# EAGLE design QT Stick (EAGLE 9.6.2)
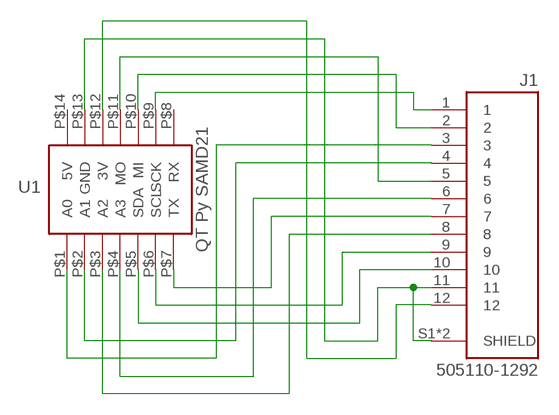
[diagram p0: schematic, sheet 1]

## Parts
J1  505110-1292  [MOLEX_505110-1292]
U1  QT Py SAMD21  QT_PY  [QT_PY]

## Nets
3V: J1.12 U1.P$12(3V)
A0/SS: J1.3 U1.P$1(A0)
A1/DR: J1.4 U1.P$2(A1)
BTN1: J1.8 U1.P$3(A2)
BTN2: J1.6 U1.P$4(A3)
BTN3: J1.7 U1.P$7(TX)
GND: J1.11 J1.S1(SHIELD) J1.S2(SHIELD) U1.P$13(GND)
MISO: J1.2 U1.P$10(MI)
MOSI: J1.5 U1.P$11(MO)
SCK: J1.1 U1.P$9(SCK)
SCL: J1.9 U1.P$6(SCL)
SDA: J1.10 U1.P$5(SDA)
Unconnected: U1.P$8(RX)

## Power pins joined to a net without a drawn wire
5V: U1.P$14(5V)

## Library data of the parts
J1 = 505110-1292:505110-1292: Conn FPC Connector SKT 12 POS 0.5mm Solder RA SMD Embossed T/R; DESCRIPTION: 12 Position FFC, FPC Connector Contacts, Bottom 0.020 (0.50mm) Surface Mount, Right Angle; DIGI-KEY_PART_NUMBER: WM12368TR-ND; MF: Molex; MP: 505110-1292; PACKAGE: None; PURCHASE-URL: https://pricing.snapeda.com/search/part/505110-1292/?ref=eda
U1 = home:QT_PY

## Net classes
0 default: width 0.152 mm

## Board
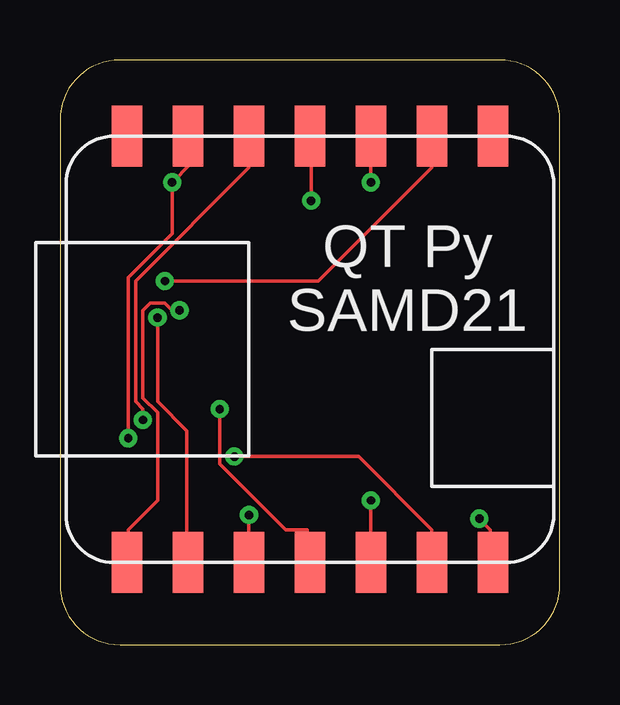
[diagram p1: board, top side]
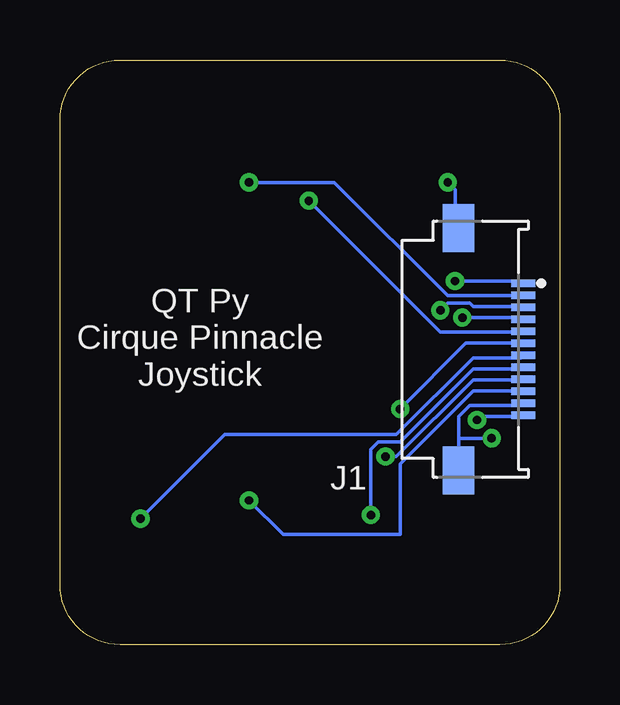
[diagram p2: board, bottom side, seen from below]

Size 20.83 x 24.38 mm. Coordinates in mm from the lower left corner, seen from the top.
Outline: 2.5,0 18.33,0 arc90 20.83,2.5 20.83,21.88 arc90 18.33,24.38 2.5,24.38 arc90 0,21.88 0,2.5 arc90 2.5,0
Copper layers (1*16): Top 0.035mm / dielectric 1.5mm / Bottom 0.035mm
Design rules "default": minimum track width 6mil, minimum drill 0.35mm, track to track 6mil, track to pad 6mil, pad to pad 6mil, via to via 6mil, smd to smd 6mil, copper to edge 40mil, drill to drill 6mil, minimum pad ring 10mil, minimum via ring 8mil, stop-mask expansion 4mil, vias tented up to drill 0mil, thermal gap 10mil

### Footprints (pad centres in the part's own frame; a part is rotated, then mirrored left to right if it is on the bottom)
MOLEX_505110-1292 = smd 0.3 x 1: 1 -2.75,0; 2 -2.25,0; 3 -1.75,0; 4 -1.25,0; 5 -0.75,0; 6 -0.25,0; 7 0.25,0; 8 0.75,0; 9 1.25,0; 10 1.75,0; 11 2.25,0; 12 2.75,0 | smd 2 x 1.3: S1 -5.05,-2.7; S2 5.05,-2.7
QT_PY = smd 1.27 x 2.54: P$1 -7.62,-8.89; P$2 -5.08,-8.89; P$3 -2.54,-8.89; P$4 0,-8.89; P$5 2.54,-8.89; P$6 5.08,-8.89; P$7 7.62,-8.89; P$8 7.62,8.89; P$9 5.08,8.89; P$10 2.54,8.89; P$11 0,8.89; P$12 -2.54,8.89; P$13 -5.08,8.89; P$14 -7.62,8.89

### Placement (x,y rotation side)
J1  1.52,12.32 270 bottom
U1  10.41,12.32 0 top

### Tracks (layer width: path | path; a pad name or v marks a point on that pad's centre or on a via)
3V  (via drill 0.35)
  Top 0.152: v3.45,9.37 3.45,9.83 3.15,10.13 3.15,15.16 7.87,19.89 U1.P$12
  Bottom 0.152: v3.45,9.37 3.3,9.53 1.63,9.53 J1.12
A0/SS  (via drill 0.35)
  Top 0.152: v4.98,13.95 4.67,13.95 4.37,14.25 3.76,14.25 3.45,13.95 3.45,10.29 4.06,9.68 4.06,6.02 2.85,4.8 U1.P$1
  Bottom 0.152: v4.98,13.95 4.67,14.25 3.76,14.25 3.61,14.1 1.63,14.1 J1.3
A1/DR  (via drill 0.35)
  Top 0.152: v4.06,13.64 4.06,10.13 5.28,8.91 5.28,4.8 U1.P$2
  Bottom 0.152: v4.06,13.64 1.63,13.64 J1.4
BTN1  (via drill 0.35)
  Top 0.152: v7.87,5.41 U1.P$3
  Bottom 0.152: J1.8 1.63,11.51 3.61,11.51 6.65,8.46 7.57,8.46 7.87,8.15 v7.87,5.41
BTN2  (via drill 0.35)
  Top 0.152: v6.65,9.83 6.65,7.54 9.4,4.8 10.31,4.8 U1.P$4
  Bottom 0.152: v6.65,9.83 3.91,12.57 1.63,12.57 J1.6
BTN3  (via drill 0.35)
  Top 0.152: U1.P$7 17.93,3.43 17.93,4.8 v17.48,5.26
  Bottom 0.152: v17.48,5.26 13.97,8.76 6.81,8.76 3.61,11.96 1.63,11.96 J1.7
GND  (via drill 0.35)
  Top 0.152: 5.44,20.04 5.44,21.11 U1.P$13 5.44,20.04 | 5.44,20.04 v4.67,19.28 4.67,17.14 2.85,15.32 v2.85,8.61
  Bottom 0.152: 4.22,8.61 4.22,7.39 J1.S2 | 4.22,8.61 4.22,9.53 3.76,9.98 1.63,9.98 J1.11 | J1.S1 4.37,17.45 4.37,18.97 v4.67,19.28 | v2.85,8.61 4.22,8.61
MISO  (via drill 0.35)
  Top 0.152: U1.P$10 13.06,20.04 13.06,21.11 U1.P$10 | v12.95,19.28 U1.P$10
  Bottom 0.152: J1.2 1.63,14.55 4.67,14.55 9.4,19.28 v12.95,19.28
MOSI  (via drill 0.35)
  Top 0.152: 10.46,20.04 10.46,21.11 U1.P$11 10.46,20.04 | v10.46,18.52 10.46,20.04
  Bottom 0.152: v10.46,18.52 4.98,13.03 1.63,13.03 J1.5
SCK  (via drill 0.35)
  Top 0.152: v4.37,15.16 10.77,15.16 15.49,19.89 U1.P$9
  Bottom 0.152: v4.37,15.16 1.63,15.16 J1.1
SCL  (via drill 0.35)
  Top 0.152: v7.26,7.85 12.45,7.85 15.49,4.8 U1.P$6
  Bottom 0.152: v7.26,7.85 6.81,7.85 3.61,11.05 1.63,11.05 J1.9
SDA  (via drill 0.35)
  Top 0.152: U1.P$5 13.06,4.65 13.06,3.43 U1.P$5 | v12.95,6.02 U1.P$5
  Bottom 0.152: J1.10 1.63,10.59 3.61,10.59 6.65,7.54 6.65,4.6 11.53,4.6 v12.95,6.02

### Text on the board
tPlace: QT Py / SAMD21
bPlace: QT Py / Cirque Pinnacle / Joystick